# Altium schematic sheet mosfets.SchDoc
size A3; SheetNumber: 3; SheetTotal: 3
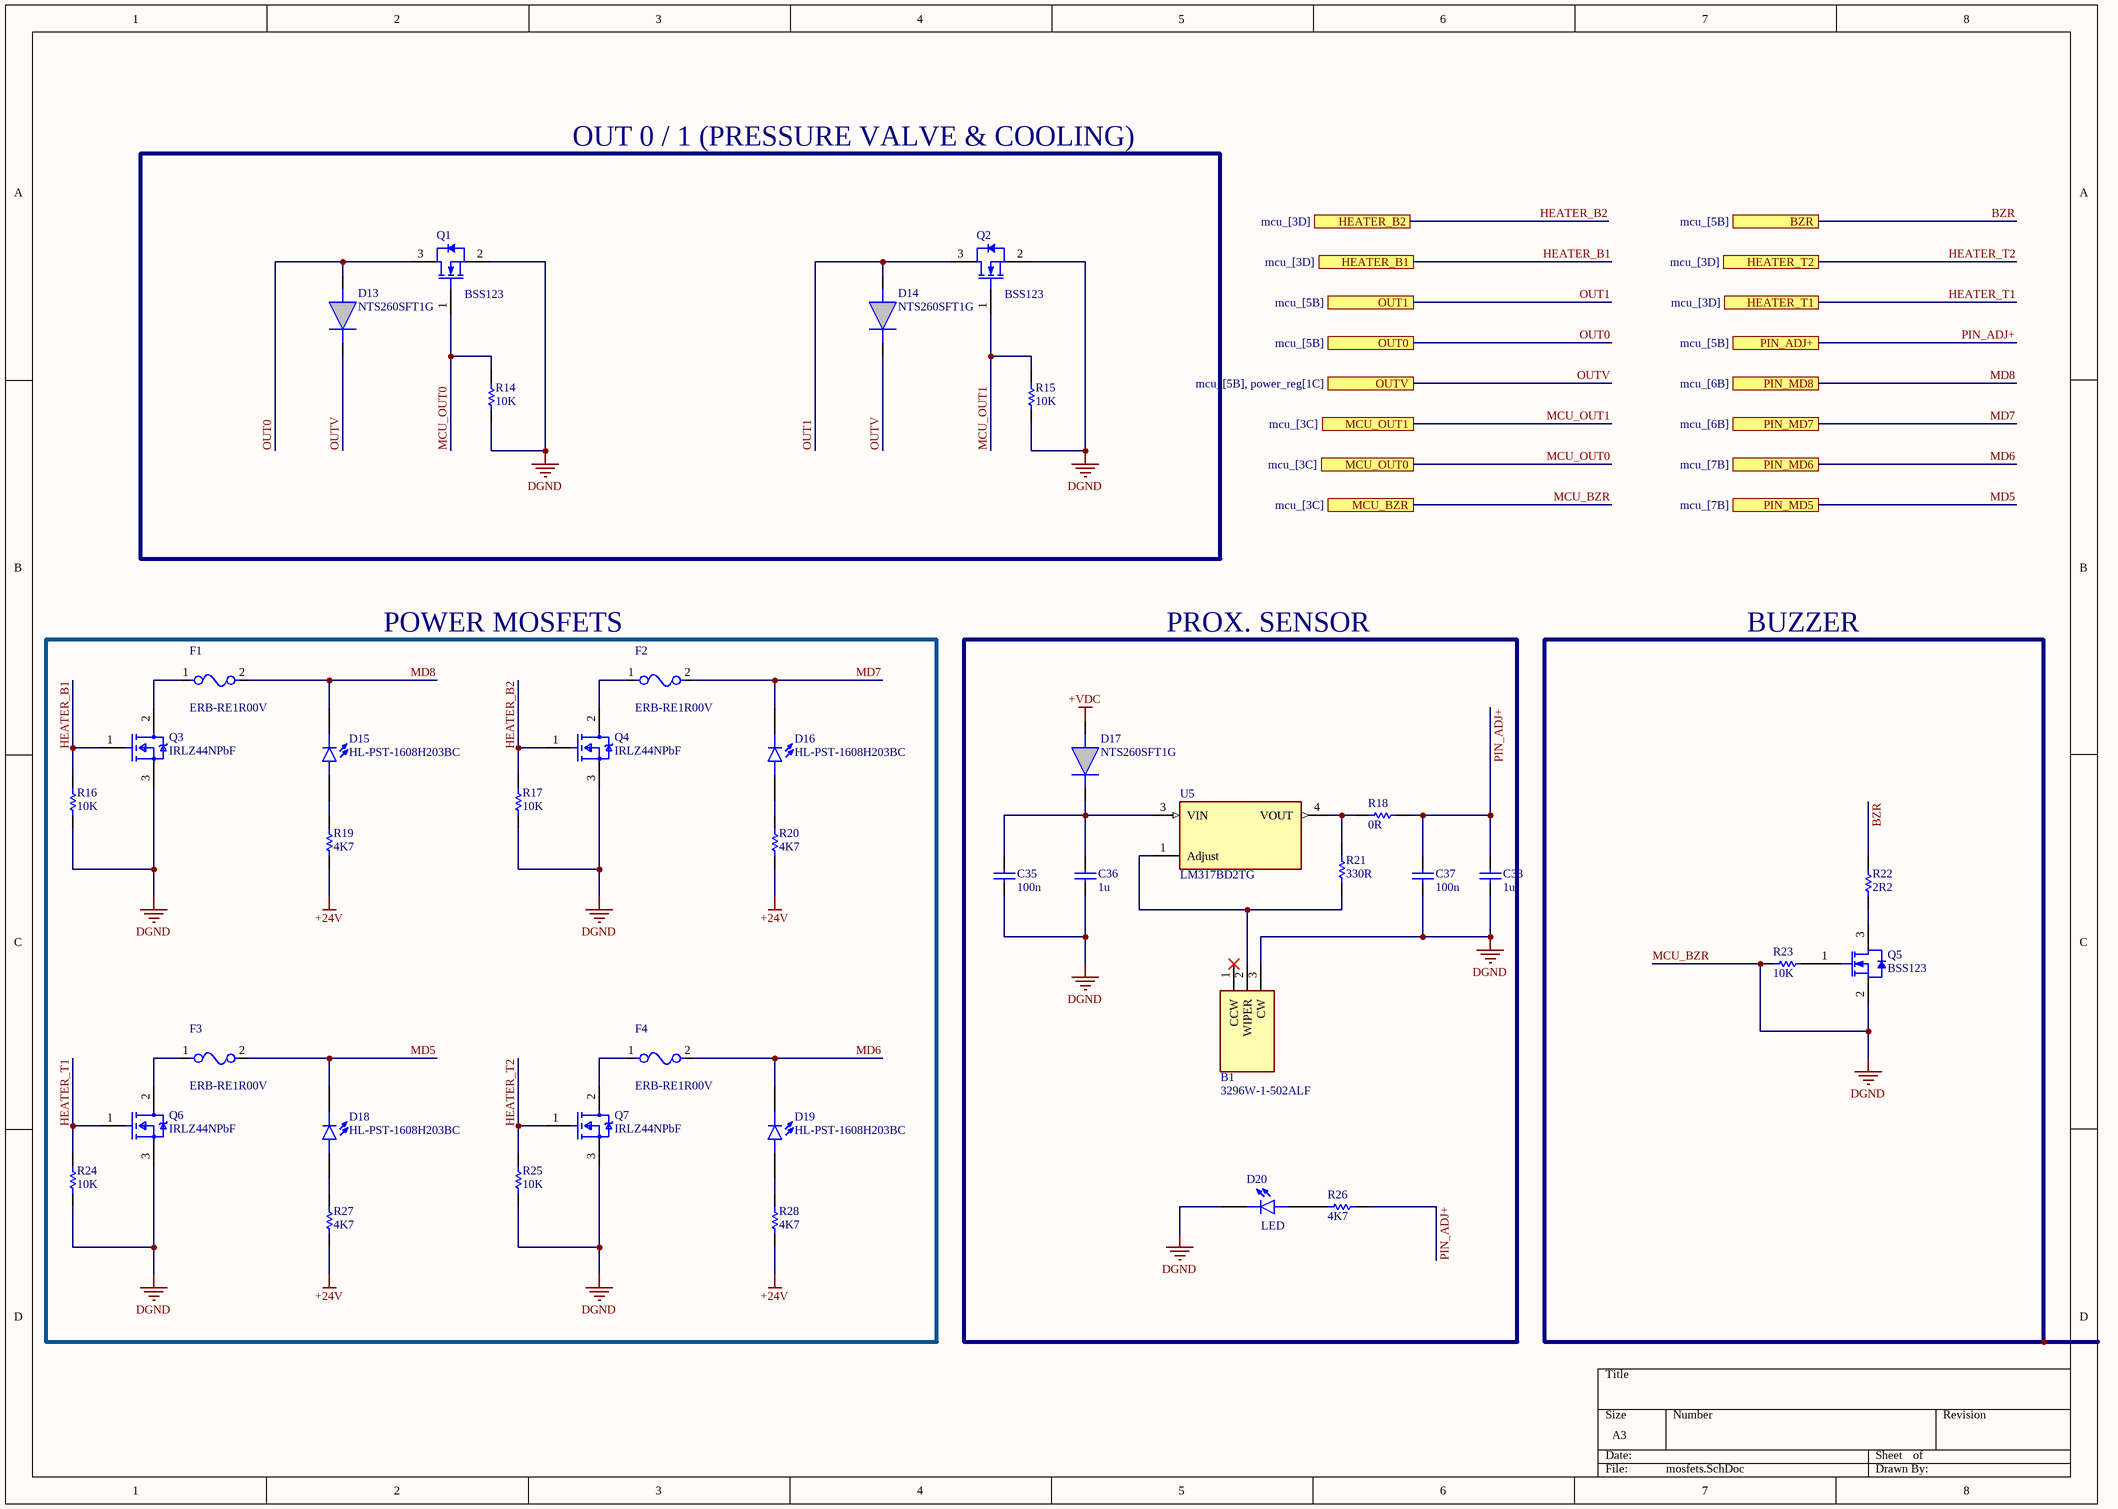
[diagram p0: mosfets.SchDoc]

## Parts
B1  3296W-1-502ALF  [3296W1502ALF]
C35  Capacitance: 100n  [0603 CAP]  (hidden comment: 1 µF ±10% 25V Ceramic Capacitor X5R 0603)
C36  Capacitance: 1u  [0603 CAP]  (hidden comment: 1 µF ±10% 25V Ceramic Capacitor X5R 0603)
C37  Capacitance: 100n  [0603 CAP]  (hidden comment: 1 µF ±10% 25V Ceramic Capacitor X5R 0603)
C38  Capacitance: 1u  [0603 CAP]  (hidden comment: 1 µF ±10% 25V Ceramic Capacitor X5R 0603)
D13  NTS260SFT1G  [SODFL3616X98N]
D14  NTS260SFT1G  [SODFL3616X98N]
D15  HL-PST-1608H203BC  [0603Diode]
D16  HL-PST-1608H203BC  [0603Diode]
D17  NTS260SFT1G  [SODFL3616X98N]
D18  HL-PST-1608H203BC  [0603Diode]
D19  HL-PST-1608H203BC  [0603Diode]
D20  LED  [0603Diode]
F1  ERB-RE1R00V  [FP-ERBRE-MFG]
F2  ERB-RE1R00V  [FP-ERBRE-MFG]
F3  ERB-RE1R00V  [FP-ERBRE-MFG]
F4  ERB-RE1R00V  [FP-ERBRE-MFG]
Q1  BSS123  [FAIR-SOT23-3_V]
Q2  BSS123  [FAIR-SOT23-3_V]
Q3  IRLZ44NPbF  [FP-PG-TO220-3-MFG]
Q4  IRLZ44NPbF  [FP-PG-TO220-3-MFG]
Q5  BSS123  [FAIR-SOT23-3_V]
Q6  IRLZ44NPbF  [FP-PG-TO220-3-MFG]
Q7  IRLZ44NPbF  [FP-PG-TO220-3-MFG]
R14  Resistance: 10K  [0603RES]  (hidden comment: CQ03SAF470JT5E)
R15  Resistance: 10K  [0603RES]  (hidden comment: CQ03SAF470JT5E)
R16  Resistance: 10K  [0603RES]  (hidden comment: CQ03SAF470JT5E)
R17  Resistance: 10K  [0603RES]  (hidden comment: CQ03SAF470JT5E)
R18  Resistance: 0R  [0603RES]  (hidden comment: 0 Ohms Jumper Chip Resistor 0603)
R19  Resistance: 4K7  [0603RES]  (hidden comment: CQ03SAF470JT5E)
R20  Resistance: 4K7  [0603RES]  (hidden comment: CQ03SAF470JT5E)
R21  Resistance: 330R  [0603RES]  (hidden comment: CQ03SAF470JT5E)
R22  Resistance: 2R2  [0603RES]  (hidden comment: CQ03SAF470JT5E)
R23  Resistance: 10K  [0603RES]  (hidden comment: CQ03SAF470JT5E)
R24  Resistance: 10K  [0603RES]  (hidden comment: CQ03SAF470JT5E)
R25  Resistance: 10K  [0603RES]  (hidden comment: CQ03SAF470JT5E)
R26  Resistance: 4K7  [0603RES]  (hidden comment: CQ03SAF470JT5E)
R27  Resistance: 4K7  [0603RES]  (hidden comment: CQ03SAF470JT5E)
R28  Resistance: 4K7  [0603RES]  (hidden comment: CQ03SAF470JT5E)
U5  LM317BD2TG  [FP-936-03-MFG]

## Blocks framed on the sheet
POWER MOSFETS: D15 D16 D18 D19 F1-F4 Q3 Q4 Q6 Q7 R16 R17 R19 R20 R24 R25 R27 R28

## Ports
BZR (see mcu_[5B]), HEATER_B1 (see mcu_[3D]), HEATER_B2 (see mcu_[3D]), HEATER_T1 (see mcu_[3D]), HEATER_T2 (see mcu_[3D]), MCU_BZR (see mcu_[3C]), MCU_OUT0 (see mcu_[3C]), MCU_OUT1 (see mcu_[3C]), OUT0 (see mcu_[5B]), OUT1 (see mcu_[5B]), OUTV (see mcu_[5B], power_reg[1C]), PIN_ADJ+ (see mcu_[5B]), PIN_MD5 (see mcu_[7B]), PIN_MD6 (see mcu_[7B]), PIN_MD7 (see mcu_[6B]), PIN_MD8 (see mcu_[6B])

## Nets
+24V: R19.1 R20.1 R27.1 R28.1
+VDC: D17.2(A)
MCU_BZR: B1.3(CW) C35.2 C36.2 C37.2 C38.2 D20.C Q1.2(S) Q2.2(S) Q3.3(S) Q4.3(S) Q5.2(S) Q6.3(S) Q7.3(S) R14.2 R15.2 R16.2 R17.2 R23.2 R24.2 R25.2 ; port MCU_BZR  [also labelled DGND]
\: D13.2(A) Q1.3(D) ; port OUT0  [also labelled OUT0]
BZR: R22.2 ; port BZR
HEATER_B1: Q3.1(G) R16.1 ; port HEATER_B1
HEATER_B2: Q4.1(G) R17.1 ; port HEATER_B2
HEATER_T1: Q6.1(G) R24.1 ; port HEATER_T1
HEATER_T2: Q7.1(G) R25.1 ; port HEATER_T2
MCU_OUT0: Q1.1(G) R14.1 ; port MCU_OUT0
MCU_OUT1: Q2.1(G) R15.1 ; port MCU_OUT1
MD5: D18.C F3.2 ; port PIN_MD5
MD6: D19.C F4.2 ; port PIN_MD6
MD7: D16.C F2.2 ; port PIN_MD7
MD8: D15.C F1.2 ; port PIN_MD8
OUT1: D14.2(A) Q2.3(D) ; port OUT1
OUTV: D13.1(K) D14.1(K) ; port OUTV
PIN_ADJ+: C37.1 C38.1 R18.2 R26.1 ; port PIN_ADJ+
NetB1_2: B1.2(WIPER) R21.1 U5.1(Adjust)
NetC35_1: C35.1 C36.1 D17.1(K) U5.3(VIN)
NetD15_A: D15.A R19.2
NetD16_A: D16.A R20.2
NetD18_A: D18.A R27.2
NetD19_A: D19.A R28.2
NetD20_A: D20.A R26.2
NetF1_1: F1.1 Q3.2(D)
NetF2_1: F2.1 Q4.2(D)
NetF3_1: F3.1 Q6.2(D)
NetF4_1: F4.1 Q7.2(D)
NetQ5_1: Q5.1(G) R23.1
NetQ5_3: Q5.3(D) R22.1
NetR18_1: R18.1 R21.2 U5.4(VOUT)

Not connected (* = marked no-connect by the designer): B1 1(CCW)*

## Notes on the sheet
- OUT 0 / 1 (PRESSURE VALVE & COOLING)
- PROX. SENSOR
- BUZZER

## Library data of the parts
B1 = 3296W-1-502ALF: Trimmer Resistors - Through Hole 3/8" 5Kohms Sealed Vertical Adjust; Manufacturer_Name: Bourns; Geometry.Height: 11.8mm; Manufacturer_Part_Number: 3296W-1-502ALF; Mouser Part Number: 652-3296W-1-502ALF; Mouser Price/Stock: https://www.mouser.co.uk/ProductDetail/Bourns/3296W-1-502ALF?qs=2esLye6h6wF9Wpw2gFsopg%3D%3D; Arrow Part Number: 3296W-1-502ALF; Arrow Price/Stock: https://www.arrow.com/en/products/3296w-1-502alf/bourns?utm_currency=USD&region=nac; Datasheet Link: https://www.bourns.com/docs/Product-Datasheets/3296.pdf
C35-C38 = C0603C104K5RAC7867: Supplier PN: CL10A105KO8NNNC; Supplier: OZDISAN; ComponentLink1Description: Supplier Link; ComponentLink1URL: https://www.ozdisan.com/pasif-komponentler/kondansatorler/smt-smd-ve-mlcc-kondansatorler/CL10A105KO8NNNC
D13 D14 D17 = NTS260SFT1G: Fine Lithography Trenchbased Schottky Technology for Very Low Forward Voltage and Low Leakage; Fast Switching with Exceptional Temperature Stability; Low Power Loss and Lower Operating Temperature; Higher Efficiency for Achieving Regulatory Compliance; Low Thermal Resistance; High Surge Capability; These are PbFree and HalideFree Devices; Manufacturer_Name: onsemi; Geometry.Height: 0.98mm; Manufacturer_Part_Number: NTS260SFT1G; Mouser Part Number: 863-NTS260SFT1G; Mouser Price/Stock: https://www.mouser.co.uk/ProductDetail/onsemi/NTS260SFT1G?qs=k6dkFvHqcvCML1heMZjMng%3D%3D; Arrow Part Number: NTS260SFT1G; Arrow Price/Stock: https://www.arrow.com/en/products/nts260sft1g/on-semiconductor; Datasheet Link: https://www.onsemi.com/pub/Collateral/NTS260SF-D.PDF
D15 D16 D18-D20 = HL-PST-1608H203BC: LED SMD 0603 BLUE 100mcd 120° WATER CLEAR; Supplier PN: HL-PST-1608H203BC; Supplier: OZDISAN; ComponentLink9Description: Supplier Link; ComponentLink9URL: https://www.ozdisan.com/led-ve-aydinlatma-cozumleri/led-komponentler/sinyal-ledler-renkli/HL-PST-1608H203BC
F1-F4 = CMP-00287-21220537-1: ERB-RE1R00V Fuse Chip Fast Acting 1A 32V SMD Solder Pad 0603 1.6 X 0.8 X 0.54mm T/R UL/cUL; Resistance: 125mΩ; Approvals: UL; Body Material: Alumina; Number of Pins: 2; RoHS: Compliant; Length: 1.6mm; Max Voltage Rating (DC): 32V; REACH SVHC: No SVHC; Case Code (Imperial): 0603; Mount: Surface Mount; Voltage Rating: 32V; Case Code (Metric): 1608; Current Rating: 1A; Width: 800µm; Min Operating Temperature: -40°C; Voltage Rating (DC): 32V; Height: 640µm; Current: 1A; Lead Free: Lead Free; Packaging: Cut Tape; Lifecycle Status: Production; Case/Package: 0603; Max Operating Temperature: 125°C; Fuse Current: 1A; Radiation Hardening: No; Depth: 800µm
Q1 Q2 Q5 = CMP-2000-04934-1: N-Channel Logic Level Enhancement Mode Field Effect Transistor, 1.7 V, -55 to 150 degC, 3-Pin SOT-23, RoHS, Tape and Reel; Manufacturer: Fairchild; Channel Type: N; Typical Turn-Off Delay Time: 17ns; Maximum Continuous Drain Current: 0.17A; Rad Hard: No; Typical Rise Time: 9ns; Typical Fall Time: 2.4ns; Maximum Gate Source Voltage: ±20V; Maximum Drain Source Voltage: 100V; Typical Turn-On Delay Time: 1.7ns; RDS-on: 6000@10VmOhm; Package Version: Rev. 12, 03/2016; Packaging: Tape&Reel; Package Reference: SOT23-3; Channel Mode: Enhancement; Operating Temperature: -55to150degC; Package Description: 3-Pin Small Outline Transistor, Body 2.92 x 1.325 mm, Pitch 0.95 mm; Category: MOSFET; Datasheet Version: Jun-03; Datasheet URL: https://www.fairchildsemi.com/datasheets/BS/BSS123.pdf; Manufacturer URL: https://www.fairchildsemi.com/; Mounting: SurfaceMount; Package: 3SOT-23; Package URL: http://www.fairchildsemi.com/dwg/MA/MA03D.pdf
Q3 Q4 Q6 Q7 = CMP-32901-000488-1: MOSFET N-CH 55V 47A TO220AB; Turn-On Delay Time: 11ns; Gate to Source Voltage (Vgs): 16V; Element Configuration: Single; Rds On Max: 22mR; Turn-Off Delay Time: 26ns; Max Power Dissipation: 110W; Threshold Voltage: 2V; Drain to Source Resistance: 35mR; Input Capacitance: 1.7nF; Continuous Drain Current (ID): 47A; Case/Package: TO-220; Lead Free: Lead Free; Halogen Free: Halogen Free; Packaging: Rail/Tube; Length: 0.414inch; Min Operating Temperature: -55°C; REACH SVHC: No SVHC; Number of Pins: 3; Width: 0.185inch; Drain to Source Voltage (Vdss): 55V; Power Dissipation: 110W; RoHS Compliant: Yes; Max Operating Temperature: 175°C; Height: 0.6inch; Max Dual Supply Voltage: 55V; Drain to Source Breakdown Voltage: 55V; Mount: Through Hole
R14-R17 R19-R28 = RC0603FR-07100RL: RES.(1608) 0603 47 Ohms 1% 1/10W AUTOMOTIV; Supplier PN: CQ03SAF470JT5E; Supplier: OZDISAN; ComponentLink1Description: Supplier Link; ComponentLink1URL: https://www.ozdisan.com/pasif-komponentler/direncler/smt-smd-ve-cip-direncler/CQ03SAF470JT5E
R18 = CRCW06030000Z0EAC: Manufacturer: Vishay; Designed By: Baran; Power Rating: 100mW; Supplier 1: Digi-Key; Manufacturer Part Number: CRCW06030000Z0EAC; RoHS: Yes; Category: Chip SMD Resistors; Stock 1: 517672; Pricing 1: 1=0.10000, 10=0.02900, 100=0.01190, 1000=0.00533, 2500=0.00463 (USD); Mount: Surface Mount; Case/Package: Molded; Contact Plating: Tin; Min Operating Temperature: -55°C; Max Operating Temperature: 155°C; Resistor Type: Thick Film; Termination: Wraparound; Length: 1.55mm; Lead Free: Lead Free; RoHS Compliant: Yes; ComponentLink1URL: http://www.vishay.com/docs/28773/crcwce3.pdf?src-supplier=Digi-Key; ComponentLink1Description: http://www.vishay.com/docs/28773/crcwce3.pdf?src-supplier=Digi-Key; Supplier Part Number 1: 541-4012-1-ND
U5 = CMP-07128-000010-1: IC REG LINEAR POS ADJ 1.5A D2PAK; Manufacturer: ON Semiconductor; Max Junction Temp: +125°C; Number Of Outputs: 1; Max Supply Voltage: 40V; Standoff Height: 0mm; Output Voltage: 1.2-37V; Output Type: AdjustableProgrammable; Mouser Description: Linear Voltage Regulators 1.5A ADJ 1.2-37V Positive; RoHS: TRUE; Footprint Url: https://www.onsemi.com/pub/Collateral/936-03.PDF; Lead Free: Yes; Height: 4.826mm; ComponentLink2Description: Datasheet; Package: 936-03; Digikey Description: IC REG LINEAR POS ADJ 1.5A D2PAK; Automotive: No; Device Class L1: Integrated Circuits (ICs); Category: IC; Output Current: 1.5A; Device Class L2: Power Management ICs; Manufacturer Part Number: LM317BD2TG; Temperature Range Low: -40°C; Temperature: -40°C to +125°C; Device Class L3: Voltage Regulators - Linear; ComponentLink2URL: https://www.onsemi.com/pub/Collateral/LM317-D.PDF; Temperature Range High: +125°C; Octopart: https://octopart.com/lm317bd2tg-on+semiconductor-1010532